# EAGLE design PGTN021_octasource2b_controls (EAGLE 9.6.0)
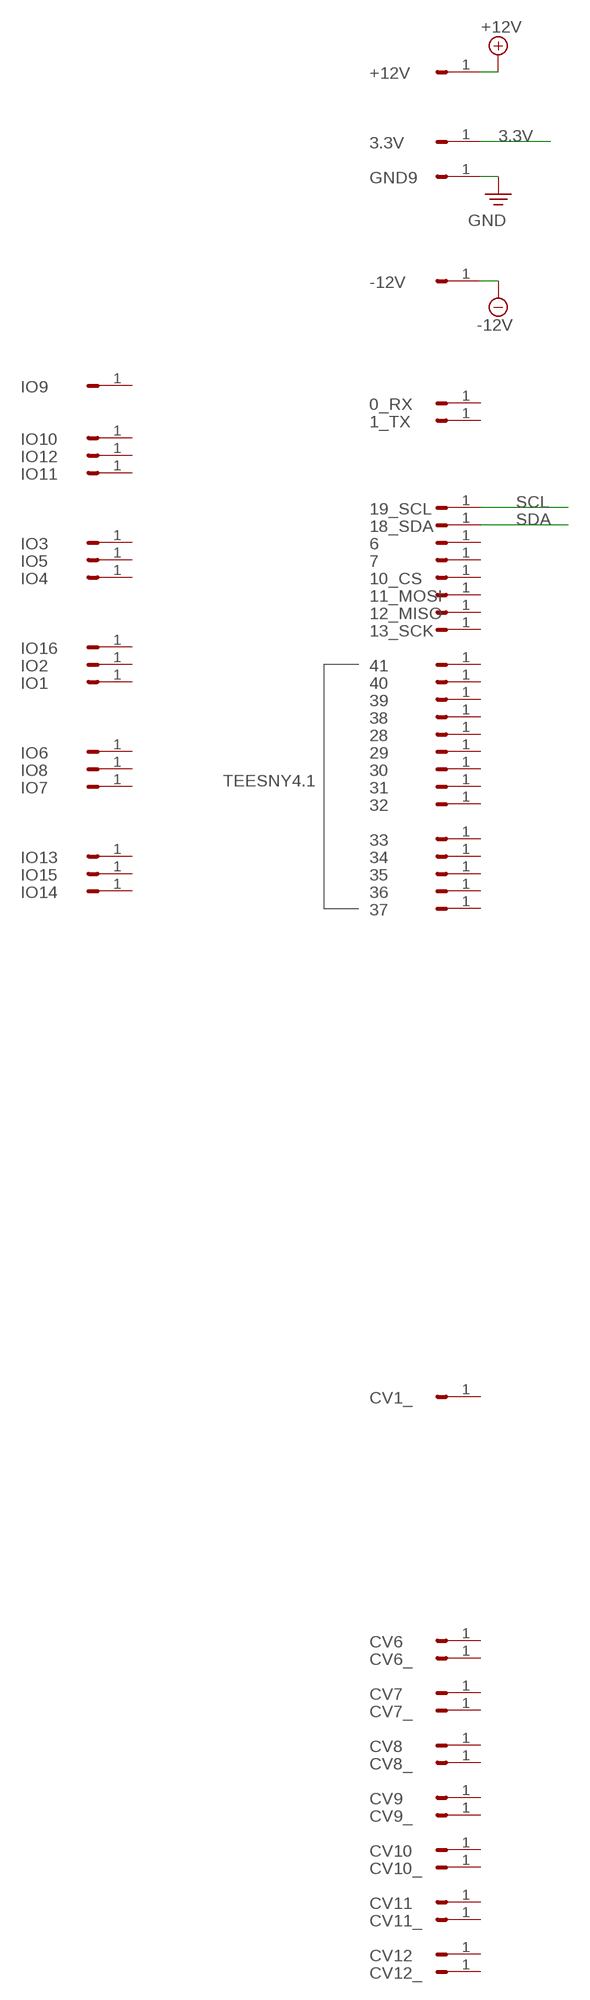
[diagram p0: schematic, sheet 1, part 1 of 2]
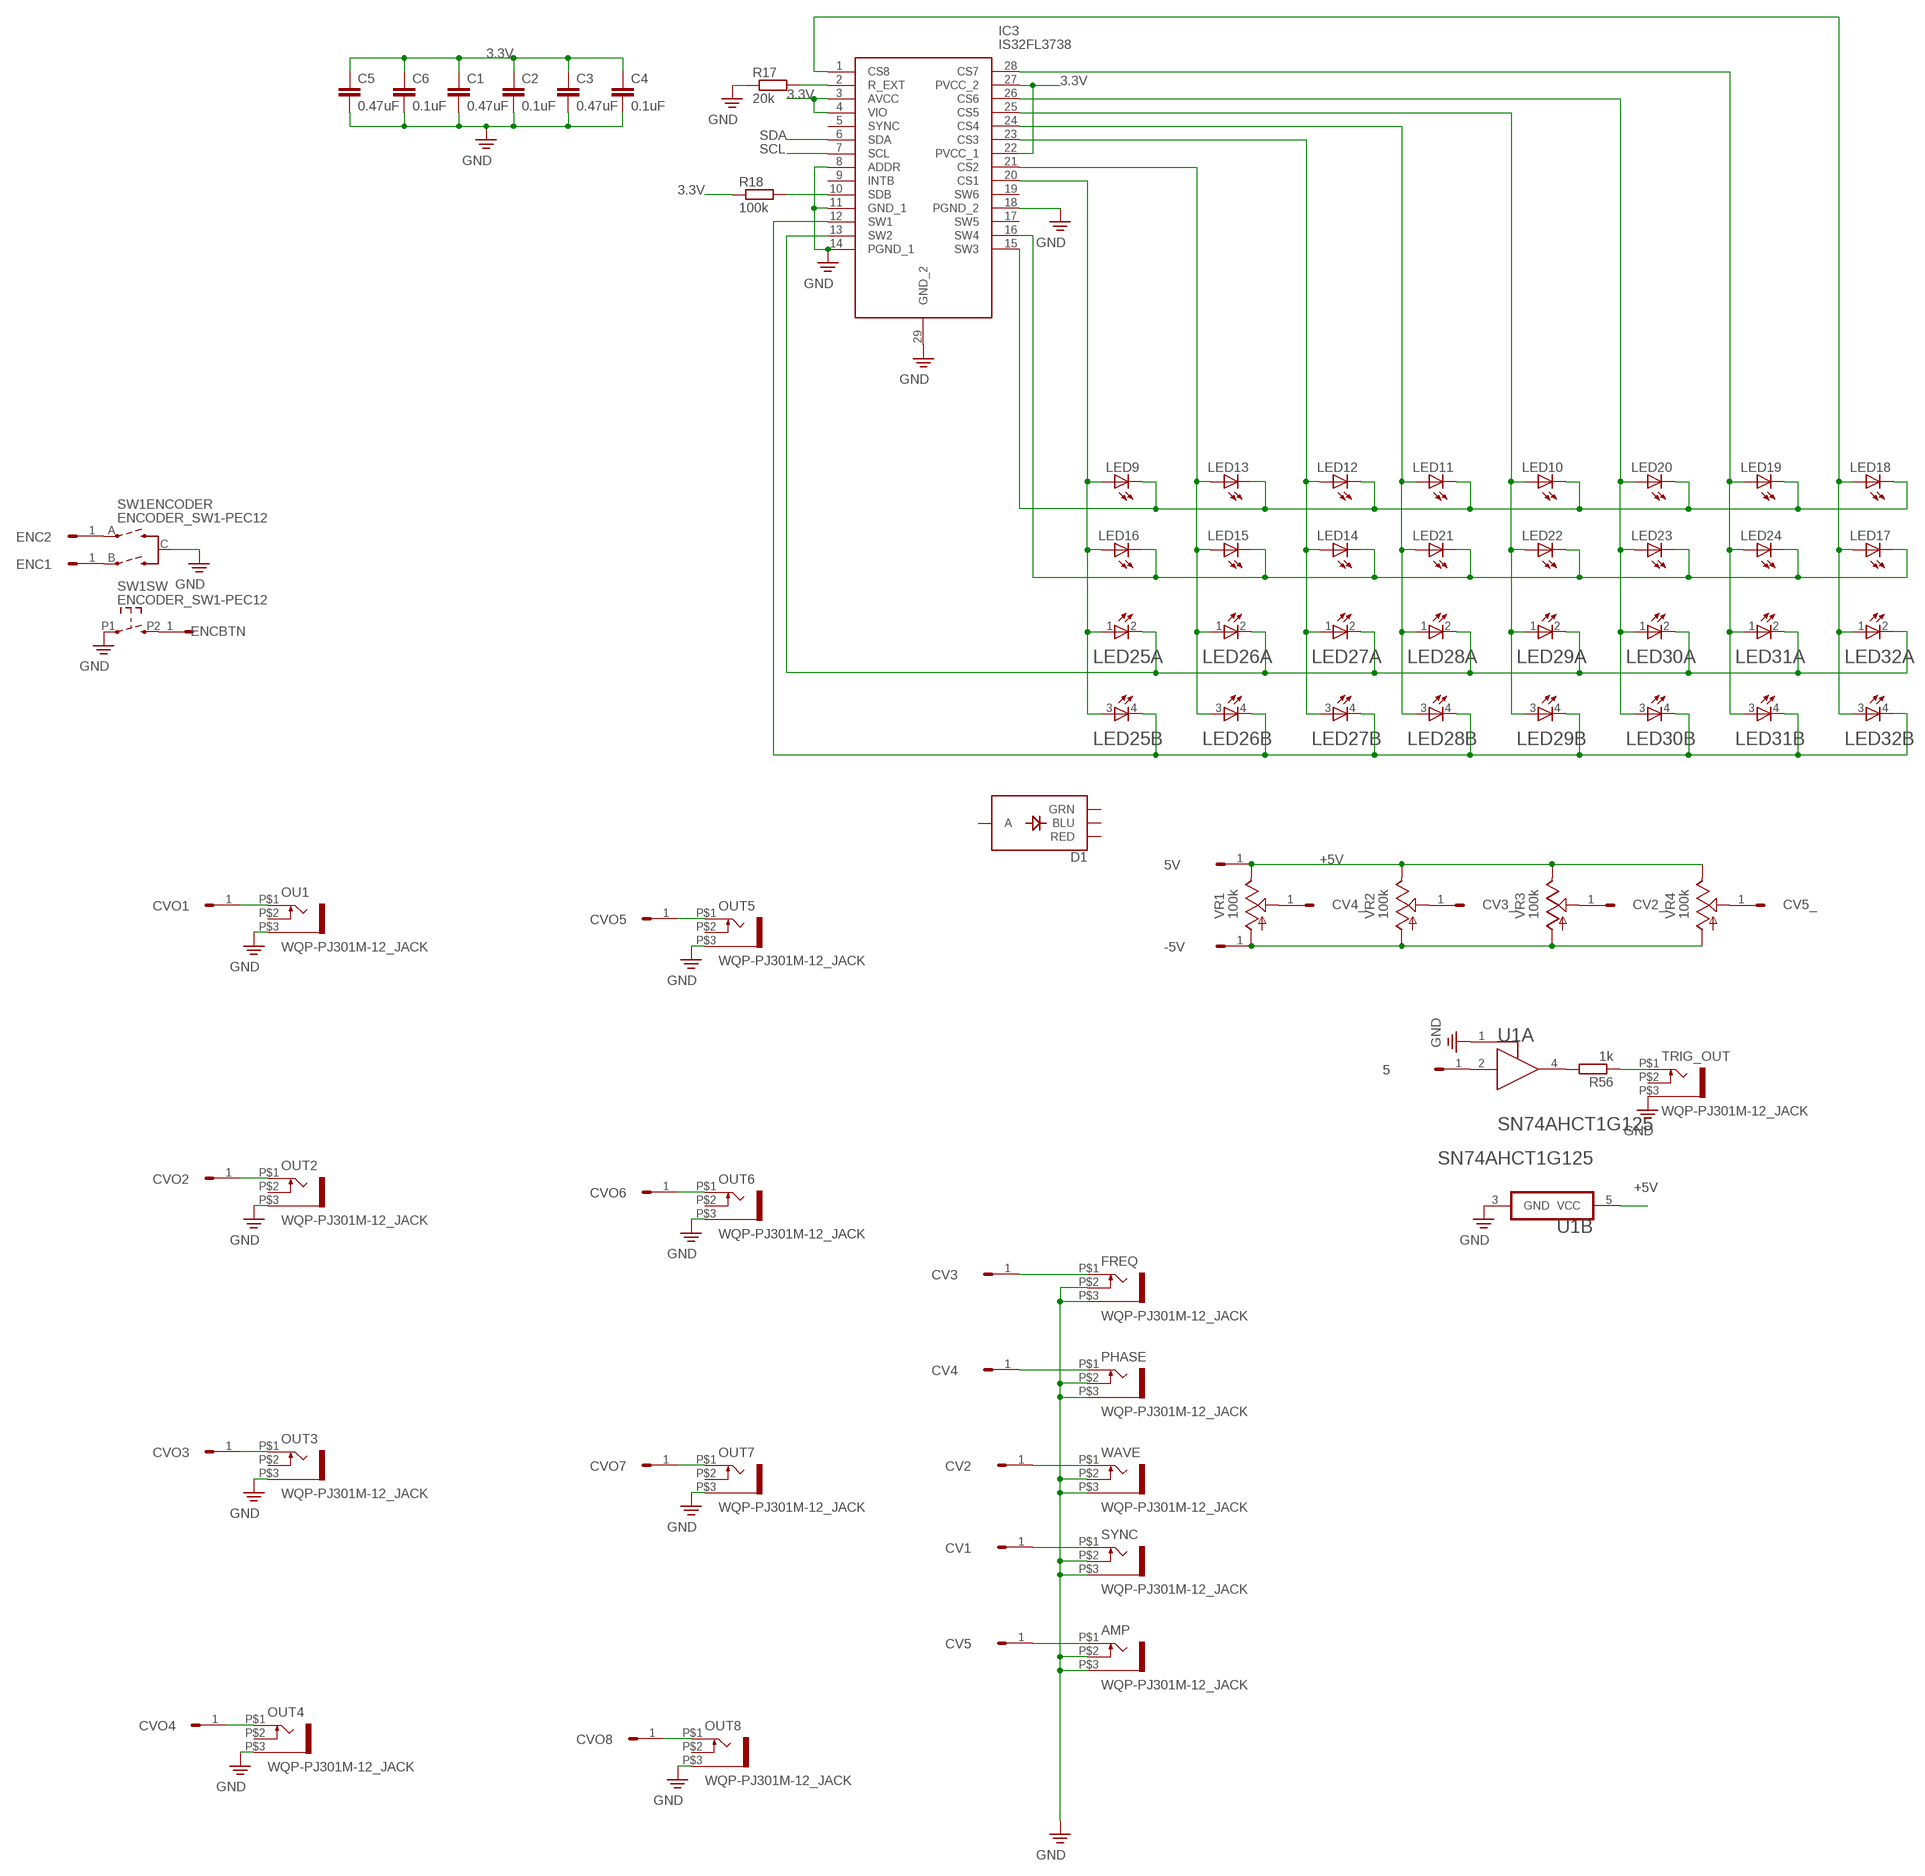
[diagram p1: schematic, sheet 1, part 2 of 2]

## Parts
0_RX  HEADER/MALE/01  [HEADER/MALE/01]
1_TX  HEADER/MALE/01  [HEADER/MALE/01]
3.3V  HEADER/MALE/01  [HEADER/MALE/01]
5  HEADER/MALE/01  [HEADER/MALE/01]
5V  HEADER/MALE/01  [HEADER/MALE/01]
6  HEADER/MALE/01  [HEADER/MALE/01]
7  HEADER/MALE/01  [HEADER/MALE/01]
10_CS  HEADER/MALE/01  [HEADER/MALE/01]
11_MOSI  HEADER/MALE/01  [HEADER/MALE/01]
12_MISO  HEADER/MALE/01  [HEADER/MALE/01]
13_SCK  HEADER/MALE/01  [HEADER/MALE/01]
18_SDA  HEADER/MALE/01  [HEADER/MALE/01]
19_SCL  HEADER/MALE/01  [HEADER/MALE/01]
28  HEADER/MALE/01  [HEADER/MALE/01]
29  HEADER/MALE/01  [HEADER/MALE/01]
30  HEADER/MALE/01  [HEADER/MALE/01]
31  HEADER/MALE/01  [HEADER/MALE/01]
32  HEADER/MALE/01  [HEADER/MALE/01]
33  HEADER/MALE/01  [HEADER/MALE/01]
34  HEADER/MALE/01  [HEADER/MALE/01]
35  HEADER/MALE/01  [HEADER/MALE/01]
36  HEADER/MALE/01  [HEADER/MALE/01]
37  HEADER/MALE/01  [HEADER/MALE/01]
38  HEADER/MALE/01  [HEADER/MALE/01]
39  HEADER/MALE/01  [HEADER/MALE/01]
40  HEADER/MALE/01  [HEADER/MALE/01]
41  HEADER/MALE/01  [HEADER/MALE/01]
+12V  HEADER/MALE/01  [HEADER/MALE/01]
-5V  HEADER/MALE/01  [HEADER/MALE/01]
-12V  HEADER/MALE/01  [HEADER/MALE/01]
AMP  WQP-PJ301M-12_JACK  [WQP-PJ301M-12_JACK]
C1  0.47uF  CAPACITORC0603  [C0603]
C2  0.1uF  CAPACITORC0603  [C0603]
C3  0.47uF  CAPACITORC0603  [C0603]
C4  0.1uF  CAPACITORC0603  [C0603]
C5  0.47uF  CAPACITORC0603  [C0603]
C6  0.1uF  CAPACITORC0603  [C0603]
CV1  HEADER/MALE/01  [HEADER/MALE/01]
CV1_  HEADER/MALE/01  [HEADER/MALE/01]
CV2  HEADER/MALE/01  [HEADER/MALE/01]
CV2_  HEADER/MALE/01  [HEADER/MALE/01]
CV3  HEADER/MALE/01  [HEADER/MALE/01]
CV3_  HEADER/MALE/01  [HEADER/MALE/01]
CV4  HEADER/MALE/01  [HEADER/MALE/01]
CV4_  HEADER/MALE/01  [HEADER/MALE/01]
CV5  HEADER/MALE/01  [HEADER/MALE/01]
CV5_  HEADER/MALE/01  [HEADER/MALE/01]
CV6  HEADER/MALE/01  [HEADER/MALE/01]
CV6_  HEADER/MALE/01  [HEADER/MALE/01]
CV7  HEADER/MALE/01  [HEADER/MALE/01]
CV7_  HEADER/MALE/01  [HEADER/MALE/01]
CV8  HEADER/MALE/01  [HEADER/MALE/01]
CV8_  HEADER/MALE/01  [HEADER/MALE/01]
CV9  HEADER/MALE/01  [HEADER/MALE/01]
CV9_  HEADER/MALE/01  [HEADER/MALE/01]
CV10  HEADER/MALE/01  [HEADER/MALE/01]
CV10_  HEADER/MALE/01  [HEADER/MALE/01]
CV11  HEADER/MALE/01  [HEADER/MALE/01]
CV11_  HEADER/MALE/01  [HEADER/MALE/01]
CV12  HEADER/MALE/01  [HEADER/MALE/01]
CV12_  HEADER/MALE/01  [HEADER/MALE/01]
CVO1  HEADER/MALE/01  [HEADER/MALE/01]
CVO2  HEADER/MALE/01  [HEADER/MALE/01]
CVO3  HEADER/MALE/01  [HEADER/MALE/01]
CVO4  HEADER/MALE/01  [HEADER/MALE/01]
CVO5  HEADER/MALE/01  [HEADER/MALE/01]
CVO6  HEADER/MALE/01  [HEADER/MALE/01]
CVO7  HEADER/MALE/01  [HEADER/MALE/01]
CVO8  HEADER/MALE/01  [HEADER/MALE/01]
D1  LED-RGB-CADIALIGHT1210  [CHIPLED_1210]
ENC1  HEADER/MALE/01  [HEADER/MALE/01]
ENC2  HEADER/MALE/01  [HEADER/MALE/01]
ENCBTN  HEADER/MALE/01  [HEADER/MALE/01]
FREQ  WQP-PJ301M-12_JACK  [WQP-PJ301M-12_JACK]
GND9  HEADER/MALE/01  [HEADER/MALE/01]
IC3  IS32FL3738  [TSSOP29]
IO1  HEADER/MALE/01  [HEADER/MALE/01]
IO2  HEADER/MALE/01  [HEADER/MALE/01]
IO3  HEADER/MALE/01  [HEADER/MALE/01]
IO4  HEADER/MALE/01  [HEADER/MALE/01]
IO5  HEADER/MALE/01  [HEADER/MALE/01]
IO6  HEADER/MALE/01  [HEADER/MALE/01]
IO7  HEADER/MALE/01  [HEADER/MALE/01]
IO8  HEADER/MALE/01  [HEADER/MALE/01]
IO9  HEADER/MALE/01  [HEADER/MALE/01]
IO10  HEADER/MALE/01  [HEADER/MALE/01]
IO11  HEADER/MALE/01  [HEADER/MALE/01]
IO12  HEADER/MALE/01  [HEADER/MALE/01]
IO13  HEADER/MALE/01  [HEADER/MALE/01]
IO14  HEADER/MALE/01  [HEADER/MALE/01]
IO15  HEADER/MALE/01  [HEADER/MALE/01]
IO16  HEADER/MALE/01  [HEADER/MALE/01]
LED9  LEDCHIPLED_0805  [CHIPLED_0805]
LED10  LEDCHIPLED_0805  [CHIPLED_0805]
LED11  LEDCHIPLED_0805  [CHIPLED_0805]
LED12  LEDCHIPLED_0805  [CHIPLED_0805]
LED13  LEDCHIPLED_0805  [CHIPLED_0805]
LED14  LEDCHIPLED_0805  [CHIPLED_0805]
LED15  LEDCHIPLED_0805  [CHIPLED_0805]
LED16  LEDCHIPLED_0805  [CHIPLED_0805]
LED17  LEDCHIPLED_0805  [CHIPLED_0805]
LED18  LEDCHIPLED_0805  [CHIPLED_0805]
LED19  LEDCHIPLED_0805  [CHIPLED_0805]
LED20  LEDCHIPLED_0805  [CHIPLED_0805]
LED21  LEDCHIPLED_0805  [CHIPLED_0805]
LED22  LEDCHIPLED_0805  [CHIPLED_0805]
LED23  LEDCHIPLED_0805  [CHIPLED_0805]
LED24  LEDCHIPLED_0805  [CHIPLED_0805]
LED25  LED-BICOLOUR  [CHIPLED_1210]
LED26  LED-BICOLOUR  [CHIPLED_1210]
LED27  LED-BICOLOUR  [CHIPLED_1210]
LED28  LED-BICOLOUR  [CHIPLED_1210]
LED29  LED-BICOLOUR  [CHIPLED_1210]
LED30  LED-BICOLOUR  [CHIPLED_1210]
LED31  LED-BICOLOUR  [CHIPLED_1210]
LED32  LED-BICOLOUR  [CHIPLED_1210]
OU1  WQP-PJ301M-12_JACK  [WQP-PJ301M-12_JACK]
OUT2  WQP-PJ301M-12_JACK  [WQP-PJ301M-12_JACK]
OUT3  WQP-PJ301M-12_JACK  [WQP-PJ301M-12_JACK]
OUT4  WQP-PJ301M-12_JACK  [WQP-PJ301M-12_JACK]
OUT5  WQP-PJ301M-12_JACK  [WQP-PJ301M-12_JACK]
OUT6  WQP-PJ301M-12_JACK  [WQP-PJ301M-12_JACK]
OUT7  WQP-PJ301M-12_JACK  [WQP-PJ301M-12_JACK]
OUT8  WQP-PJ301M-12_JACK  [WQP-PJ301M-12_JACK]
PHASE  WQP-PJ301M-12_JACK  [WQP-PJ301M-12_JACK]
R17  20k  RESISTOR  [R0603]
R18  100k  RESISTOR  [R0603]
R56  1k  RESISTOR  [R0603]
SW1  ENCODER_SW1-PEC12  [PEC12_INCREMENTAL_ENCODER]
SYNC  WQP-PJ301M-12_JACK  [WQP-PJ301M-12_JACK]
TRIG_OUT  WQP-PJ301M-12_JACK  [WQP-PJ301M-12_JACK]
U1  74AHCT1G125"  [74AHCT1G125]
VR1  100k  9MM_SNAP-IN_POT_  [9MM_SNAP-IN_POT]
VR2  100k  9MM_SNAP-IN_POT_  [9MM_SNAP-IN_POT]
VR3  100k  9MM_SNAP-IN_POT_  [9MM_SNAP-IN_POT]
VR4  100k  9MM_SNAP-IN_POT_  [9MM_SNAP-IN_POT]
WAVE  WQP-PJ301M-12_JACK  [WQP-PJ301M-12_JACK]

## Nets
3.3V: 3.3V.1 C1.1 C2.1 C3.1 C4.1 C5.1 C6.1 IC3.3(AVCC) IC3.4(VIO) IC3.22(PVCC_1) IC3.27(PVCC_2) R18.1
+5V: 5V.1 U1.5(B:VCC) VR1.3(E) VR2.3(E) VR3.3(E) VR4.3(E)
+12V: +12V.1
-12V: -12V.1
N$4: CVO1.1 OU1.P$1
N$8: CVO2.1 OUT2.P$1
N$12: CVO3.1 OUT3.P$1
N$16: CVO4.1 OUT4.P$1
N$20: CVO5.1 OUT5.P$1
N$24: CVO6.1 OUT6.P$1
N$28: CVO7.1 OUT7.P$1
N$32: CVO8.1 OUT8.P$1
N$33: IC3.10(SDB) R18.2
N$34: R56.2 U1.4(A:Y)
N$35: 5.1 U1.2(A:A)
N$36: ENCBTN.1 SW1.P2
N$37: ENC2.1 SW1.A(ENCODER:A)
N$38: ENC1.1 SW1.B(ENCODER:B)
N$39: CV1.1 SYNC.P$1
N$40: -5V.1 VR1.1(A) VR2.1(A) VR3.1(A) VR4.1(A)
N$41: CV2.1 WAVE.P$1
N$42: CV3.1 FREQ.P$1
N$43: CV4.1 PHASE.P$1
N$44: AMP.P$1 CV5.1
N$45: CV2_.1 VR3.2(S)
N$46: CV3_.1 VR2.2(S)
N$47: CV4_.1 VR1.2(S)
N$48: CV5_.1 VR4.2(S)
N$49: R56.1 TRIG_OUT.P$1
N$50: IC3.20(CS1) LED9.A LED16.A LED25.1(A:GREEN_ANODE) LED25.3(B:YELLOW_ANODE)
N$51: IC3.21(CS2) LED13.A LED15.A LED26.1(A:GREEN_ANODE) LED26.3(B:YELLOW_ANODE)
N$52: IC3.23(CS3) LED12.A LED14.A LED27.1(A:GREEN_ANODE) LED27.3(B:YELLOW_ANODE)
N$53: IC3.13(SW2) LED25.2(A:GREEN_CATHODE) LED26.2(A:GREEN_CATHODE) LED27.2(A:GREEN_CATHODE) LED28.2(A:GREEN_CATHODE) LED29.2(A:GREEN_CATHODE) LED30.2(A:GREEN_CATHODE) LED31.2(A:GREEN_CATHODE) LED32.2(A:GREEN_CATHODE)
N$56: IC3.12(SW1) LED25.4(B:YELLOW_CATHODE) LED26.4(B:YELLOW_CATHODE) LED27.4(B:YELLOW_CATHODE) LED28.4(B:YELLOW_CATHODE) LED29.4(B:YELLOW_CATHODE) LED30.4(B:YELLOW_CATHODE) LED31.4(B:YELLOW_CATHODE) LED32.4(B:YELLOW_CATHODE)
N$62: IC3.16(SW4) LED14.C LED15.C LED16.C LED17.C LED21.C LED22.C LED23.C LED24.C
N$63: IC3.15(SW3) LED9.C LED10.C LED11.C LED12.C LED13.C LED18.C LED19.C LED20.C
N$65: IC3.24(CS4) LED11.A LED21.A LED28.1(A:GREEN_ANODE) LED28.3(B:YELLOW_ANODE)
N$66: IC3.25(CS5) LED10.A LED22.A LED29.1(A:GREEN_ANODE) LED29.3(B:YELLOW_ANODE)
N$67: IC3.26(CS6) LED20.A LED23.A LED30.1(A:GREEN_ANODE) LED30.3(B:YELLOW_ANODE)
N$68: IC3.28(CS7) LED19.A LED24.A LED31.1(A:GREEN_ANODE) LED31.3(B:YELLOW_ANODE)
N$69: IC3.1(CS8) LED17.A LED18.A LED32.1(A:GREEN_ANODE) LED32.3(B:YELLOW_ANODE)
N$70: IC3.2(R_EXT) R17.2
PE: AMP.P$2 AMP.P$3 C1.2 C2.2 C3.2 C4.2 C5.2 C6.2 FREQ.P$2 FREQ.P$3 GND9.1 IC3.8(ADDR) IC3.11(GND_1) IC3.14(PGND_1) IC3.18(PGND_2) IC3.29(GND_2) OU1.P$3 OUT2.P$3 OUT3.P$3 OUT4.P$3 OUT5.P$3 OUT6.P$3 OUT7.P$3 OUT8.P$3 PHASE.P$2 PHASE.P$3 R17.1 SW1.C(ENCODER:C) SW1.P1 SYNC.P$2 SYNC.P$3 TRIG_OUT.P$3 U1.1(A:!OE!) U1.3(B:GND) WAVE.P$2 WAVE.P$3 ; supply symbol labelled GND
SCL: 19_SCL.1 IC3.7(SCL)
SDA: 18_SDA.1 IC3.6(SDA)
Unconnected: 0_RX.1 1_TX.1 6.1 7.1 10_CS.1 11_MOSI.1 12_MISO.1 13_SCK.1 28.1 29.1 30.1 31.1 32.1 33.1 34.1 35.1 36.1 37.1 38.1 39.1 40.1 41.1 CV1_.1 CV6.1 CV6_.1 CV7.1 CV7_.1 CV8.1 CV8_.1 CV9.1 CV9_.1 CV10.1 CV10_.1 CV11.1 CV11_.1 CV12.1 CV12_.1 D1.1(BLU) D1.2(RED) D1.3(GRN) D1.4(A) IC3.5(SYNC) IC3.9(INTB) IC3.17(SW5) IC3.19(SW6) IO1.1 IO2.1 IO3.1 IO4.1 IO5.1 IO6.1 IO7.1 IO8.1 IO9.1 IO10.1 IO11.1 IO12.1 IO13.1 IO14.1 IO15.1 IO16.1 OU1.P$2 OUT2.P$2 OUT3.P$2 OUT4.P$2 OUT5.P$2 OUT6.P$2 OUT7.P$2 OUT8.P$2 TRIG_OUT.P$2

## Notes on the sheet
- TEESNY4.1

## Library data of the parts
0_RX 1_TX 3.3V 5 5V 6 7 10_CS 11_MOSI 12_MISO 13_SCK 18_SDA 19_SCL 28-41 +12V -5V -12V CV1 CV1_ CV2 CV2_ CV3 CV3_ CV4 CV4_ CV5 CV5_ CV6 CV6_ CV7 CV7_ CV8 CV8_ CV9 CV9_ CV10 CV10_ CV11 CV11_ CV12 CV12_ CVO1-CVO8 ENC1 ENC2 ENCBTN GND9 IO1-IO16 = connectors:HEADER/MALE/01; SPICEPREFIX: X
AMP FREQ OU1 OUT2-OUT8 PHASE SYNC TRIG_OUT WAVE = controls:WQP-PJ301M-12_JACK
C1-C6 = capacitors:CAPACITOR: CAPACITOR, European symbol
D1 = display_led:LED-RGB-CA: LED-RGB Diffused Common Anode Packages: LED RGB-THRU P-LCC-4-3 LED-TRICOLOR-SMD SparkFun Products: RGB Diffused Common Anode- Diffuse <[https://www.sparkfun.com/products/10821]> RGB Diffused Common Anode - Clear <[https://www.sparkfun.com/products/10820]> Qduino Mini <[https://www.sparkfun.com/products/13614]> Triple Output LED RGB - SMD <https://www.sparkfun.com/products/7844>
IC3 = ic_digital:IS32FL3738: IC LED DRIVER 6X8 28TSSOP Source: Datasheet <http://www.issi.com/WW/pdf/IS32FL3738.pdf>; DESCRIPTION: IC LED DRIVER 6X8 28TSSOP; HEIGHT: 1.2mm; MANUFACTURER_NAME: ISSI, Integrated Silicon Solution Inc; MANUFACTURER_PART_NUMBER: IS32FL3738-ZLA3-TR
LED9-LED24 = display_led:LED: LED OSRAM: - CHIPLED LG R971, LG N971, LY N971, LG Q971, LY Q971, LO R971, LY R971 LH N974, LH R974 LS Q976, LO Q976, LY Q976 LO Q996 - Hyper CHIPLED LW Q18S LB Q993, LB Q99A, LB R99A - SideLED LS A670, LO A670, LY A670, LG A670, LP A670 LB A673, LV A673, LT A673, LW A673 LH A674 LY A675 LS A676, LA A676, LO A676, LY A676, LW A676 LS A679, LY A679, LG A679 - Hyper Micro SIDELED® LS Y876, LA Y876, LO Y876, LY Y876 LT Y87S - SmartLED LW L88C, LW L88S LB L89C, LB L89S, LG L890 LS L89K, LO L89K, LY L89K LS L896, LA L896, LO L896, LY L896 - TOPLED LS T670, LO T670, LY T670, LG T670, LP T670 LSG T670, LSP T670, LSY T670, LOP T670, LYG T670 LG T671, LOG T671, LSG T671 LB T673, LV T673, LT T673, LW T673 LH T674 LS T676, LA T676, LO T676, LY T676, LB T676, LH T676, LSB T676, LW T676 LB T67C, LV T67C, LT T67C, LS T67K, LO T67K, LY T67K, LW E67C LS E67B, LA E67B, LO E67B, LY E67B, LB E67C, LV E67C, LT E67C LW T67C LS T679, LY T679, LG T679 LS T770, LO T770, LY T770, LG T770, LP T770 LB T773, LV T773, LT T773, LW T773 LH T774 LS E675, LA E675, LY E675, LS T675 LS T776, LA T776, LO T776, LY T776, LB T776 LHGB T686 LT T68C, LB T68C - Hyper Mini TOPLED® LB M676 - Mini TOPLED Santana® LG M470 LS M47K, LO M47K, LY M47K Source: http://www.osram.convergy.de LUXEON: - LUMILED® LXK2-PW12-R00, LXK2-PW12-S00, LXK2-PW14-U00, LXK2-PW14-V00 LXK2-PM12-R00, LXK2-PM12-S00, LXK2-PM14-U00 LXK2-PE12-Q00, LXK2-PE12-R00, LXK2-PE12-S00, LXK2-PE14-T00, LXK2-PE14-U00 LXK2-PB12-K00, LXK2-PB12-L00, LXK2-PB12-M00, LXK2-PB14-N00, LXK2-PB14-P00, LXK2-PB14-Q00 LXK2-PR12-L00, LXK2-PR12-M00, LXK2-PR14-Q00, LXK2-PR14-R00 LXK2-PD12-Q00, LXK2-PD12-R00, LXK2-PD12-S00 LXK2-PH12-R00, LXK2-PH12-S00 LXK2-PL12-P00, LXK2-PL12-Q00, LXK2-PL12-R00 Source: www.luxeon.com KINGBRIGHT: KA-3528ASYC Source: www.kingbright.com
LED25-LED32 = display_led:LED-BICOLOUR: LED Bi-Color Green/Yellow 4-Pin Chip 1210(3225Metric) T/R; AUTOMOTIVE: No; CENTROID_NOT_SPECIFIED: No; COLOUR: Yellow, Green; DATASHEET: http://www.dialightsignalsandcomponents.com/Assets/Brochures_And_Catalogs/Indication/CBI_SMD_new/Dialight_CBI_data_598-1210bi_Jul2018.pdf; DEVICE_CLASS_L1: Optoelectronics; DEVICE_CLASS_L2: LEDs; DEVICE_CLASS_L3: unset; DIGIKEY_DESCRIPTION: LED GREEN/YELLOW CLEAR 1210 SMD; DIGIKEY_PART_NUMBER: 350-2083-1-ND; FOOTPRINT_VARIANT_NAME_0: Recommended_Land_Pattern; FORWARD_CURRENT: 20mA; FORWARD_VOLTAGE: 2.1/2.1V; HEIGHT: 0.8mm; LEAD_FREE: Yes; LED_ORIENTATION: Top View; LUMINOUS_INTENSITY: 155/40mcd; MAX_JUNCTION_TEMP: +105°C; MF: Dialight; MFG_PACKAGE_IDENT: 598-86; MFG_PACKAGE_IDENT_COMPONENT_ID: 50b93d2fef35f251; MFG_PACKAGE_IDENT_DATE: 0; MFG_PACKAGE_IDENT_REV: 0; MOUSER_DESCRIPTION: Standard LEDs - SMD Yellow/Green WC 150/50mcd 592/570nm; MOUSER_PART_NUMBER: 645-598-8640-207F; MPN: 598-8640-207F; PACKAGE: 1210; POWER_DISSIPATION: 48/48W; PREFIX: D; REVERSE_VOLTAGE: 5V; ROHS: Yes; TEMPERATURE_RANGE_HIGH: +100°C; TEMPERATURE_RANGE_LOW: -40°C; VERIFICATION_VERSION: 0.0.0.3; VIEWING_ANGLE: 140°; WAVELENGTH: 590/570nm
R17 R18 R56 = resistors:RESISTOR: RESISTOR, European symbol
SW1 = controls:ENCODER_SW1: Incremental Encoder with push switch
U1 = ic_digital:74AHCT1G125: TI-SN74AXXXX1X125-5; 3_STATE_OUTPUT: Yes; BITS: 1; CIIVA_IDS: 19361320; DATASHEET_VERSION: SCLS378M; FOOTPRINT_VARIANT_NAME_0: Level C; FOOTPRINT_VARIANT_NAME_1: Level B; FOOTPRINT_VARIANT_NAME_2: Level A; F__NOM_VOLTAGEMAXMHZ: 75; ICC__NOM_VOLTAGEMAXMA: 0.01; IMPORTED: yes; IMPORTED_FROM: vault; IMPORT_TS: 1521860152; INPUT_TYPE: CMOS; LOGIC: true; MF: Texas Instruments; MPN: SN74AHCT1G125; OPERATING_TEMPERATURE_RANGEC: -40 to 125; OUTPUT_DRIVE_IOLIOHMAXMA: 8/-8; OUTPUT_TYPE: CMOS; PACKAGE: DBV0005A; PIN_0_0_1_OUTSIDE_EDGE: dot; PREFIX: U; RATING: Catalog; RELEASE_DATE: 1459324136; SCHMITT_TRIGGER: No; SUB__FAMILY: Non-Inverting Buffer/Driver; TECHNOLOGY_FAMILY: AHCT; TPD__NOM_VOLTAGEMAXNS: 6; VAULT_GUID: D4F6E077-2F5C-4B23-8C12-AA7674079390; VAULT_REVISION: 30C08C77-DC7B-43EA-A3AC-F2B0253DD8E6; VCC_MAX_V: 5.5; VCC_MIN_V: 2; VOLTAGE_NOM_V: 5
VR1-VR4 = controls:9MM_SNAP-IN_POT: 9mm vertical snap-in pot, Alpha / Panasonic style

## Board
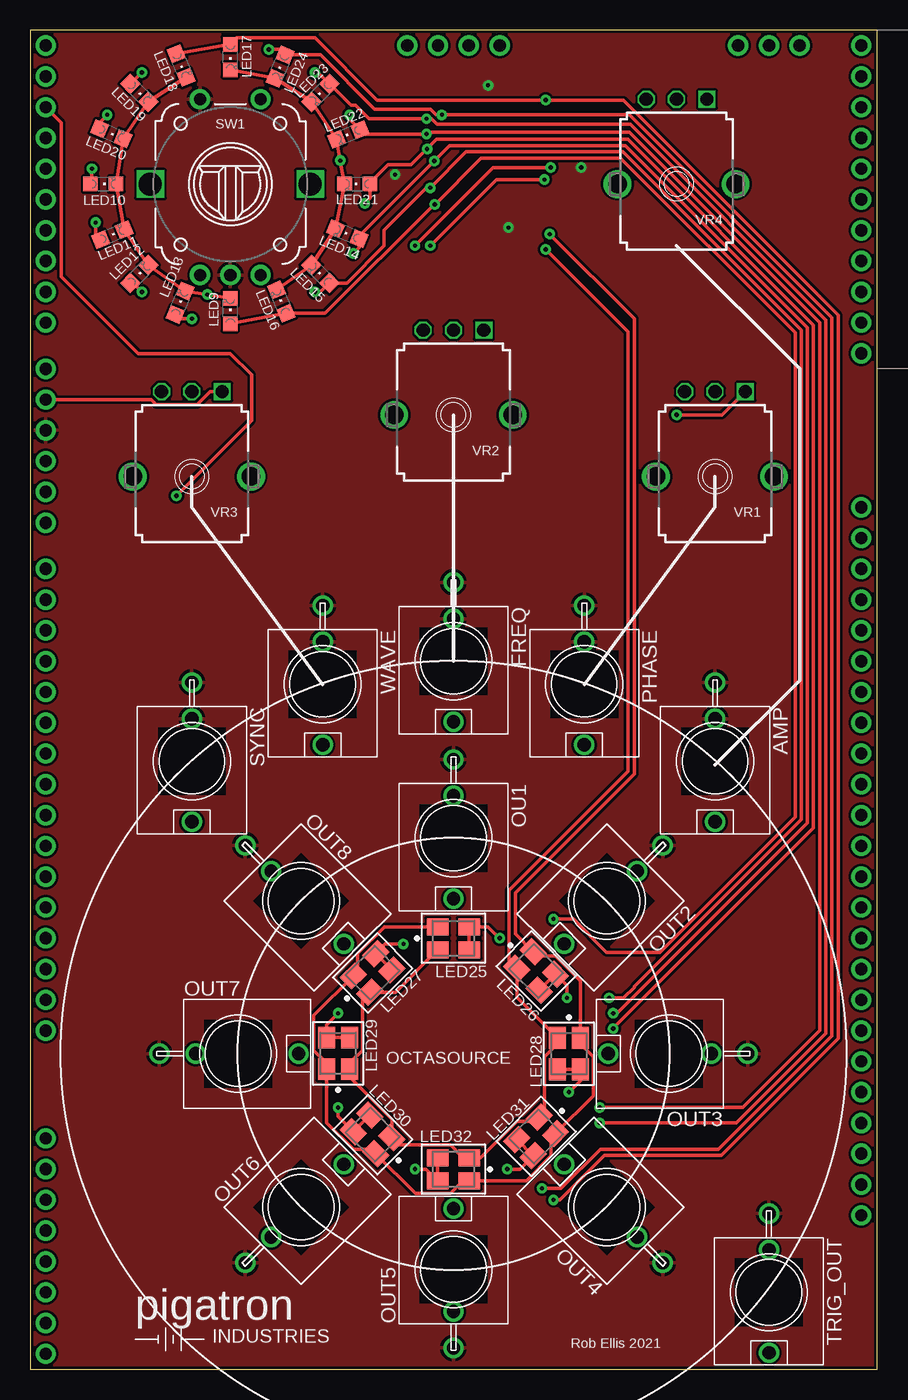
[diagram p2: board, top side]
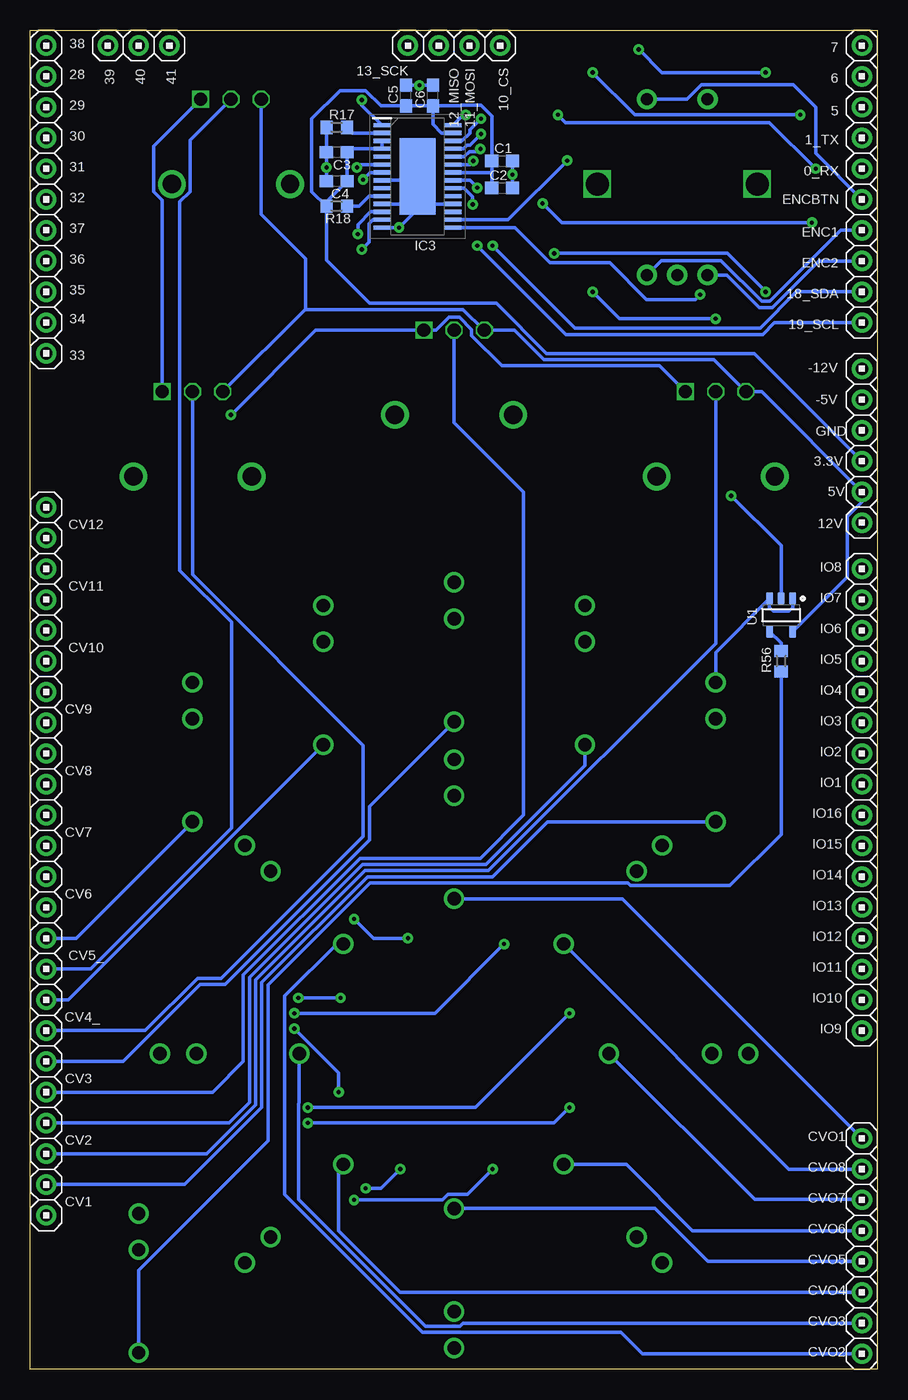
[diagram p3: board, bottom side, seen from below]

Size 69.9 x 110.48 mm. Coordinates in mm from the lower left corner, seen from the top.
Outline: 0,0 69.9,0 69.9,110.48 0,110.48 0,0
Copper layers (1*16): Top 0.0356mm / dielectric 1.5011mm / Bottom 0.0356mm
Design rules "pigatron *": minimum track width 8mil, minimum drill 13mil, track to track 8mil, track to pad 8mil, pad to pad 8mil, via to via 8mil, smd to smd 6mil, copper to edge 10mil, drill to drill 10mil, minimum pad ring 6mil, minimum via ring 10mil, stop-mask expansion 4mil, vias tented up to drill 0mil, thermal gap 10mil

### Footprints (pad centres in the part's own frame; a part is rotated, then mirrored left to right if it is on the bottom)
HEADER/MALE/01 = drill 1.016 pad 1.676: 1 0,0
WQP-PJ301M-12_JACK = drill 1.1 pad 1.676: P$1 0,5; P$2 0,-3.5; P$3 0,-6.5
C0603 = smd 1.1 x 1: 1 -0.85,0; 2 0.85,0
CHIPLED_1210 = smd 1.8 x 1.4: 1 -1.3,0.95; 2 1.3,0.95; 3 -1.3,-0.95; 4 1.3,-0.95
TSSOP29 = smd 1.4 x 0.35: 1 -2.938,4.225; 2 -2.938,3.575; 3 -2.938,2.925; 4 -2.938,2.275; 5 -2.938,1.625; 6 -2.938,0.975; 7 -2.938,0.325; 8 -2.938,-0.325; 9 -2.938,-0.975; 10 -2.938,-1.625; 11 -2.938,-2.275; 12 -2.938,-2.925; 13 -2.938,-3.575; 14 -2.938,-4.225; 15 2.938,-4.225; 16 2.938,-3.575; 17 2.938,-2.925; 18 2.938,-2.275; 19 2.938,-1.625; 20 2.938,-0.975; 21 2.938,-0.325; 22 2.938,0.325; 23 2.938,0.975; 24 2.938,1.625; 25 2.938,2.275; 26 2.938,2.925; 27 2.938,3.575; 28 2.938,4.225 | smd 3 x 6.3: 29 0,0
CHIPLED_0805 = smd 1.2 x 1.2: A 0,-1.05; C 0,1.05
R0603 = smd 1 x 1.1: 1 -0.85,0; 2 0.85,0
PEC12_INCREMENTAL_ENCODER = drill 1 pad 1.676: A -2.5,-7.5; B 2.5,-7.5; C 0,-7.5; P1 -2.5,7; P2 2.5,7 | drill 1.9 square: GND@1 -6.6,0; GND@2 6.6,0
74AHCT1G125 = smd 1 x 0.6: 1 -1.375,0.95; 2 -1.375,0; 3 -1.375,-0.95; 4 1.375,-0.95; 5 1.375,0.95
9MM_SNAP-IN_POT = drill 1.1 square: 1 -2.5,-7 | drill 1.1 octagon: 2 0,-7; 3 2.5,-7 | drill 1.524 pad 2.286: CHASSIS1 -4.881,0; CHASSIS2 4.881,0

### Placement (x,y rotation side)
0_RX  1.27,99.06 180 bottom
1_TX  1.27,101.6 180 bottom
3.3V  1.27,74.93 90 bottom
5  1.27,104.14 180 bottom
5V  1.27,72.39 180 bottom
6  1.27,106.68 180 bottom
7  1.27,109.22 180 bottom
10_CS  31.11,109.22 270 bottom
11_MOSI  33.66,109.22 270 bottom
12_MISO  36.2,109.22 270 bottom
13_SCK  38.73,109.22 270 bottom
18_SDA  1.27,88.9 180 bottom
19_SCL  1.27,86.36 180 bottom
28  68.58,106.68 0 bottom
29  68.58,104.14 0 bottom
30  68.58,101.6 0 bottom
31  68.58,99.06 0 bottom
32  68.58,96.52 0 bottom
33  68.58,83.82 0 bottom
34  68.58,86.36 0 bottom
35  68.58,88.9 0 bottom
36  68.58,91.44 0 bottom
37  68.58,93.98 0 bottom
38  68.58,109.22 0 bottom
39  63.5,109.22 270 bottom
40  60.96,109.22 270 bottom
41  58.42,109.22 270 bottom
+12V  1.27,69.85 0 bottom
-5V  1.27,80.01 0 bottom
-12V  1.27,82.55 0 bottom
AMP  56.52,50.16 180 top
C1  30.96,99.69 0 bottom
C2  30.96,97.47 0 bottom
C3  44.61,100.41 180 bottom
C4  44.61,98.03 180 bottom
C5  38.89,105.09 90 bottom
C6  36.67,105.09 90 bottom
CV1  68.58,15.24 0 bottom
CV1_  68.58,12.7 0 bottom
CV2  68.58,20.32 0 bottom
CV2_  68.58,17.78 0 bottom
CV3  68.58,25.4 0 bottom
CV3_  68.58,22.86 0 bottom
CV4  68.58,30.48 0 bottom
CV4_  68.58,27.94 0 bottom
CV5  68.58,35.56 180 bottom
CV5_  68.58,33.02 180 bottom
CV6  68.58,40.64 180 bottom
CV6_  68.58,38.1 180 bottom
CV7  68.58,43.18 180 bottom
CV7_  68.58,45.72 180 bottom
CV8  68.58,50.8 180 bottom
CV8_  68.58,48.26 180 bottom
CV9  68.58,53.34 180 bottom
CV9_  68.58,55.88 180 bottom
CV10  68.58,60.96 180 bottom
CV10_  68.58,58.42 180 bottom
CV11  68.58,66.04 180 bottom
CV11_  68.58,63.5 180 bottom
CV12  68.58,68.58 180 bottom
CV12_  68.58,71.12 180 bottom
CVO1  1.27,19.05 0 bottom
CVO2  1.27,1.27 0 bottom
CVO3  1.27,3.81 0 bottom
CVO4  1.27,6.35 0 bottom
CVO5  1.27,8.89 0 bottom
CVO6  1.27,11.43 0 bottom
CVO7  1.27,13.97 0 bottom
CVO8  1.27,16.51 0 bottom
D1  -13.97,-10.16 0 top  (outside the outline)
ENC1  1.27,93.98 180 bottom
ENC2  1.27,91.44 180 bottom
ENCBTN  1.27,96.52 180 bottom
FREQ  34.92,58.42 180 top
GND9  1.27,77.47 0 bottom
IC3  37.94,98.42 0 bottom
IO1  1.27,48.26 180 bottom
IO2  1.27,50.8 180 bottom
IO3  1.27,53.34 180 bottom
IO4  1.27,55.88 180 bottom
IO5  1.27,58.42 180 bottom
IO6  1.27,60.96 180 bottom
IO7  1.27,63.5 180 bottom
IO8  1.27,66.04 180 bottom
IO9  1.27,27.94 180 bottom
IO10  1.27,30.48 180 bottom
IO11  1.27,33.02 180 bottom
IO12  1.27,35.56 180 bottom
IO13  1.27,38.1 180 bottom
IO14  1.27,40.64 180 bottom
IO15  1.27,43.18 180 bottom
IO16  1.27,45.72 180 bottom
LED9  16.51,87.31 0 top
LED10  6.03,97.79 270 top
LED11  6.77,93.62 292.5 top
LED12  8.99,90.37 315 top
LED13  12.36,88.01 337.5 top
LED14  26.15,93.69 67.5 top
LED15  23.94,90.37 45 top
LED16  20.71,88.09 22.5 top
LED17  16.51,108.27 180 top
LED18  12.45,107.56 202.5 top
LED19  8.99,105.32 225 top
LED20  6.68,101.95 247.5 top
LED21  26.99,97.79 90 top
LED22  26.24,101.88 112.5 top
LED23  23.94,105.32 135 top
LED24  20.62,107.48 157.5 top
LED25  34.92,35.56 180 top
LED26  41.75,32.86 135 top
LED27  28.26,32.7 225 top
LED28  44.45,26.04 90 top
LED29  25.4,26.06 270 top
LED30  28.26,19.37 315 top
LED31  41.75,19.21 45 top
LED32  34.92,16.51 0 top
OU1  34.92,43.81 180 top
OUT2  47.6,38.63 135 top
OUT3  52.7,26.04 90 top
OUT4  47.6,13.37 45 top
OUT5  34.92,8.26 0 top
OUT6  22.34,13.37 315 top
OUT7  17.14,26.04 270 top
OUT8  22.34,38.63 225 top
PHASE  45.72,56.52 180 top
R17  44.61,102.47 0 bottom
R18  44.61,95.96 0 bottom
R56  7.94,58.42 90 bottom
SW1  16.51,97.79 0 top
SYNC  13.34,50.16 180 top
TRIG_OUT  60.96,6.35 180 top
U1  7.94,62.23 270 bottom
U$1  [PIGATRON-LOGO]  17.53,4.06 0 top
VR1  56.52,73.66 180 top
VR2  34.92,78.74 180 top
VR3  13.34,73.66 180 top
VR4  53.34,97.79 180 top
WAVE  24.13,56.52 180 top

### Tracks (layer width: path | path; a pad name or v marks a point on that pad's centre or on a via)
3.3V
  Bottom 0.305: 31.81,98.74 C1.1 31.81,103.4 32.7,104.29 34.3,104.29 34.34,104.24 C6.1 | 31.81,98.74 C2.1 | IC3.22 31.81,98.75 31.81,98.74 | C6.1 C5.1 40.95,104.24 42.22,105.51 44.35,105.51 46.67,103.19 46.67,97.18 R18.1 | IC3.27 35.96,102 36.67,102.71 C6.1 | IC3.3 IC3.4 43.47,100.7 C3.1 C4.1 45.46,96.33 R18.1 | R18.1 45.46,91.5 41.91,87.95 31.43,87.95 27.3,83.82 10.16,83.82 3.3V.1
+5V
  Bottom 0.305: 47.24,87.43 47.18,87.5 47.18,91.63 50.84,95.29 VR4.3 | 47.24,87.43 VR1.3 | 47.24,87.43 34.17,87.43 32.48,85.74 VR2.3 29.94,85.74 27.52,83.31 13.49,83.31 VR3.3 9.54,80.66 5V.1 1.27,71.54 2.46,70.34 2.46,65.38 U1.5
N$4
  Bottom 0.305: OU1.P$1 21.59,38.81 21.04,38.81 CVO1.1
N$8
  Bottom 0.305: OUT2.P$1 44.6,35.09 48.9,30.8 48.9,26.53 48.9,14.44 37.51,3.05 21.15,3.05 19.37,1.27 CVO2.1
N$12
  Bottom 0.305: OUT3.P$1 47.7,21.98 47.77,21.91 47.77,14.04 37.3,3.56 34.43,3.56 34.18,3.81 CVO3.1
N$16
  Bottom 0.305: OUT4.P$1 44.45,16.52 44.45,11.43 39.37,6.35 CVO4.1
N$20
  Bottom 0.305: OUT5.P$1 18.34,13.26 13.97,8.89 CVO5.1
N$24
  Bottom 0.305: OUT6.P$1 20.72,16.91 15.24,11.43 CVO6.1
N$28
  Bottom 0.305: OUT7.P$1 10.12,14.01 1.31,14.01 CVO7.1
N$32
  Bottom 0.305: OUT8.P$1 7.3,16.51 CVO8.1
N$33
  Bottom 0.305: R18.2 42.78,95.96 41.95,96.8 IC3.10
N$34
  Bottom 0.305: U1.4 7.94,59.91 R56.2
N$35  (via drill 0.35)
  Top 0.305: v12.06,72.07 18.26,78.26 18.26,82.07 16.51,83.82 8.89,83.82 2.54,90.17 2.54,102.87 5.1
  Bottom 0.305: U1.2 7.94,67.94 v12.06,72.07
N$36
  Bottom 0.305: SW1.P2 15.7,104.79 14.5,105.98 6.92,105.98 5.08,104.14 5.08,100.33 ENCBTN.1
N$37
  Bottom 0.305: SW1.A 12.43,90.29 9.74,87.61 8.67,87.61 4.84,91.44 ENC2.1
N$38
  Bottom 0.305: SW1.B 17.82,91.48 12.9,91.48 9.53,88.11 8.88,88.11 3.02,93.98 ENC1.1
N$39
  Bottom 0.305: SYNC.P$1 27.23,45.16 31.75,40.64 42.07,40.64 50.8,31.91 50.8,21.59 57.15,15.24 CV1.1
N$40  (via drill 0.35)
  Top 0.305: v53.34,78.74 57.09,78.74 VR1.1 | VR3.1 14.83,80.66 13.77,79.6 10.4,79.6 9.99,80.01 -5V.1
  Bottom 0.305: v53.34,78.74 46.34,85.74 VR2.1 36.42,85.74 35.36,86.8 34.49,86.8 33.48,85.79 33.48,85.3 30.98,82.8 17.98,82.8 VR3.1 | VR1.1 59.02,96.47 59.72,97.17 59.72,100.91 VR4.1
N$41
  Bottom 0.305: WAVE.P$1 24.13,49.8 32.28,41.66 42.49,41.66 51.82,32.33 51.82,22.01 53.51,20.32 CV2.1
N$42
  Bottom 0.305: FREQ.P$1 41.91,46.44 41.91,43.67 53.83,31.75 55.88,31.75 62.23,25.4 CV3.1
N$43
  Bottom 0.305: PHASE.P$1 66.75,30.48 CV4.1
N$44
  Bottom 0.305: AMP.P$1 66.08,35.6 66.12,35.56 CV5.1
N$45
  Bottom 0.305: VR3.2 13.34,59.88 32.07,41.15 42.28,41.15 51.31,32.12 51.31,21.8 55.33,17.78 CV2_.1
N$46
  Bottom 0.305: VR2.2 34.92,78.11 29.21,72.39 29.21,45.72 32.77,42.16 42.7,42.16 52.32,32.54 52.32,25.4 54.74,22.99 54.86,22.86 CV3_.1
N$47
  Bottom 0.305: VR1.2 56.52,65.56 42.42,51.47 42.42,43.97 54.13,32.26 56.09,32.26 60.41,27.94 CV4_.1
N$48
  Bottom 0.305: VR4.2 56.72,101.41 56.72,97.17 57.57,96.32 57.57,65.9 53.3,61.63 53.3,44.65 64.85,33.1 64.93,33.02 CV5_.1
N$49
  Bottom 0.305: R56.1 7.94,44.13 12.16,39.91 20.36,39.91 20.59,40.13 41.86,40.13 50.29,31.7 50.29,18.83 60.96,8.16 TRIG_OUT.P$1
N$50  (via drill 0.35)
  Top 0.305: LED9.A LED16.A 24.34,87.12 33.33,96.11 v33.39,96.11 37.22,99.94 48.7,99.94 63.12,85.52 63.12,45.58 51.95,34.41 47.54,34.41 44.81,37.15 v43.18,37.15 | LED25.1 LED25.3 37.78,36.51 v38.73,35.56
  Bottom 0.305: v43.18,37.15 41.59,35.56 v38.73,35.56 | IC3.20 34.09,97.45 33.39,96.75 v33.39,96.11
N$51  (via drill 0.35)
  Top 0.305: v23.5,88.9 23.95,88.9 LED15.A 26.13,89.63 29.21,92.71 29.21,93.98 32.72,97.49 v33.02,97.49 35.98,100.45 48.91,100.45 63.63,85.73 63.63,45.37 49.85,31.59 49.85,31.52 48.97,30.64 v47.78,30.64 | v13.34,86.68 12.32,86.68 LED13.A | LED26.1 LED26.3 44.29,31.66 v44.29,30.64
  Bottom 0.305: v23.5,88.9 21.27,86.68 v13.34,86.68 | v47.78,30.64 v44.29,30.64 | v33.02,97.49 33.17,97.64 33.63,98.1 IC3.21
N$52  (via drill 0.35)
  Top 0.305: v26.67,92.08 27.12,92.52 LED14.A 27.12,93.48 v33.34,99.69 34.6,100.96 49.12,100.96 64.14,85.94 64.14,45.09 48.42,29.37 v48.1,29.37 | v9.21,88.9 8.48,89.63 LED12.A | LED27.1 LED27.3 29.3,35.08 v30.8,35.08
  Bottom 0.305: v26.67,92.08 12.38,92.08 v9.21,88.9 | IC3.23 33.63,99.4 v33.34,99.69 | v48.1,29.37 36.51,29.37 v30.8,35.08
N$53  (via drill 0.35)
  Top 0.305: LED25.2 30.13,31.11 LED27.2 27.41,30.51 27.41,26.32 26.35,25.26 LED29.2 26.35,24.11 29.85,20.61 LED30.2 30.45,18.52 34.67,18.52 35.73,17.46 LED32.2 37.17,17.46 40.15,20.45 41.65,20.45 LED31.2 42.44,21.25 42.44,25.78 43.5,26.84 LED28.2 40.16,30.68 LED26.2 39.52,33.75 39.52,39.52 49.34,49.34 49.34,85.6 v42.55,92.39
  Bottom 0.305: v42.55,92.39 41.94,93 41.94,94.52 41.61,94.85 IC3.13
N$56  (via drill 0.35)
  Top 0.305: LED25.4 29.23,36.51 27.02,34.3 27.02,32.81 LED27.4 23.39,29.18 23.39,26.32 24.45,25.26 LED29.4 24.45,20.34 26.66,18.13 28.15,18.13 LED30.4 31.78,14.5 34.67,14.5 35.73,15.56 LED32.4 40.94,15.56 42.99,17.61 42.99,19.11 LED31.4 46.46,22.57 46.46,25.78 45.4,26.84 LED28.4 45.4,32.05 43.35,34.1 41.85,34.1 LED26.4 40.03,35.93 40.03,39.31 49.85,49.13 49.85,86.68 v42.86,93.66
  Bottom 0.305: v42.86,93.66 42.86,94.46 41.82,95.5 IC3.12
N$62  (via drill 0.35)
  Top 0.305: LED16.C LED15.C LED14.C LED21.C v25.59,99.73 LED22.C LED23.C LED24.C LED17.C
  Bottom 0.305: IC3.16 30.46,94.85 v25.59,99.73
N$63  (via drill 0.35)
  Top 0.305: LED18.C LED19.C LED20.C LED10.C LED11.C LED12.C LED13.C v14.62,88.67 LED9.C
  Bottom 0.305: IC3.15 29.91,94.2 27,91.29 22.07,91.29 19.05,88.27 15.03,88.27 v14.62,88.67
N$65  (via drill 0.35)
  Top 0.305: v27.62,96.2 28.04,96.62 LED21.A 28.04,97.89 29.53,99.38 31.43,99.38 v32.75,100.69 33.54,101.49 49.31,101.49 64.64,86.15 64.64,44.66 48.1,28.12 v48.1,28.1 | v5.4,94.61 5.4,93.62 LED11.A | LED28.1 LED28.3 45.4,23.81 v44.45,22.86
  Bottom 0.305: v27.62,96.2 26.04,94.61 v5.4,94.61 | IC3.24 34.09,100.05 33.66,100.48 32.97,100.48 v32.75,100.69 | v48.1,28.1 47.23,27.23 47.21,27.23 44.45,24.47 v44.45,22.86
N$66  (via drill 0.35)
  Top 0.305: v26.35,103.5 26.35,103.14 LED22.A 27.57,101.92 v32.7,101.92 32.86,102.08 49.44,102.08 64.96,86.55 65.15,86.36 65.15,27.94 58.8,21.59 v46.99,21.59 | v5.08,99.06 5.08,97.89 LED10.A | LED29.1 LED29.3 24.45,28.42 v25.4,29.37
  Bottom 0.305: v26.35,103.5 25.72,102.87 8.89,102.87 v5.08,99.06 | IC3.25 34.16,100.7 33.87,100.99 33.63,100.99 v32.7,101.92 | v46.99,21.59 33.18,21.59 v25.4,29.37
N$67  (via drill 0.35)
  Top 0.305: v23.5,107 23.75,107 LED23.A 26.45,104.29 26.85,104.29 27.96,103.19 v32.7,103.19 33.09,103.19 33.56,102.72 49.51,102.72 65.66,86.57 65.66,27.73 58.25,20.32 v46.99,20.32 | v6.35,103.5 5.71,102.86 LED20.A | LED30.1 LED30.3 25.4,20.88 v25.4,21.59
  Bottom 0.305: v23.5,107 20,103.5 v6.35,103.5 | v32.7,103.19 33.63,102.26 33.63,102 34.27,101.35 IC3.26 | v46.99,20.32 26.67,20.32 v25.4,21.59
N$68  (via drill 0.35)
  Top 0.305: v19.68,108.9 20.57,108.9 LED24.A 23.95,108.45 28.43,103.97 33.03,103.97 33.49,103.5 v33.97,103.5 49.45,103.5 66.17,86.78 66.17,27.52 56.8,18.15 47.05,18.15 43.81,14.92 v42.23,14.92 | v9.21,107 8.27,106.06 LED19.A | LED31.1 LED31.3 40.4,16.51 v39.37,16.51
  Bottom 0.305: v19.68,108.9 17.78,107 v9.21,107 | IC3.28 34.15,103.5 v33.97,103.5 | v39.37,16.51 40.96,14.92 v42.23,14.92
N$69  (via drill 0.35)
  Top 0.305: LED18.A LED17.A 17.05,109.86 23.5,109.86 28.62,104.73 v42.55,104.73 48.94,104.73 66.67,87 66.67,27.3 57.02,17.64 47.38,17.64 43.7,13.97 v43.18,13.97 | LED32.1 LED32.3 32.67,16.51 v31.75,16.51
  Bottom 0.305: IC3.1 42.55,104.32 v42.55,104.73 | v43.18,13.97 35.9,13.97 35.42,14.45 33.81,14.45 v31.75,16.51
N$70
  Bottom 0.305: R17.2 43.29,102 IC3.2
PE  (via drill 0.35)
  Bottom 0.305: C6.2 v37.78,105.94 C5.2 | C2.2 v30.11,98.58 C1.2 | R17.1 C3.2 v45.46,99.16 C4.2 | IC3.8 38.27,98.1 IC3.29 | IC3.11 39.1,96.15 37.94,97.31 | IC3.18 36.78,96.15 37.94,97.31 | 37.94,97.31 IC3.29 | IC3.14 v39.47,94.2 37.94,95.73 IC3.29 | U1.1 6.99,62.87 7.3,62.55 8.57,62.55 8.89,62.86 U1.3 13.34,59.16 SYNC.P$3
  pour Top: 69.85,110.49 0,110.49 0,0 69.85,0
SCL  (via drill 0.35)
  Top 0.305: v42.44,98.16 38.47,98.16 v33.02,92.71
  Bottom 0.305: IC3.7 41.85,98.75 v42.44,98.16 | v33.02,92.71 25.7,85.39 9.46,85.39 8.48,86.36 19_SCL.1
SDA  (via drill 0.35)
  Top 0.305: v42.94,99.16 38.2,99.16 v31.75,92.71
  Bottom 0.305: v31.75,92.71 24.93,85.89 9.67,85.89 6.66,88.9 18_SDA.1 | IC3.6 42.7,99.4 v42.94,99.16

### Text on the board
tNames: OCTASOURCE | Rob Ellis 2021
bNames: -12V | GND | 12V